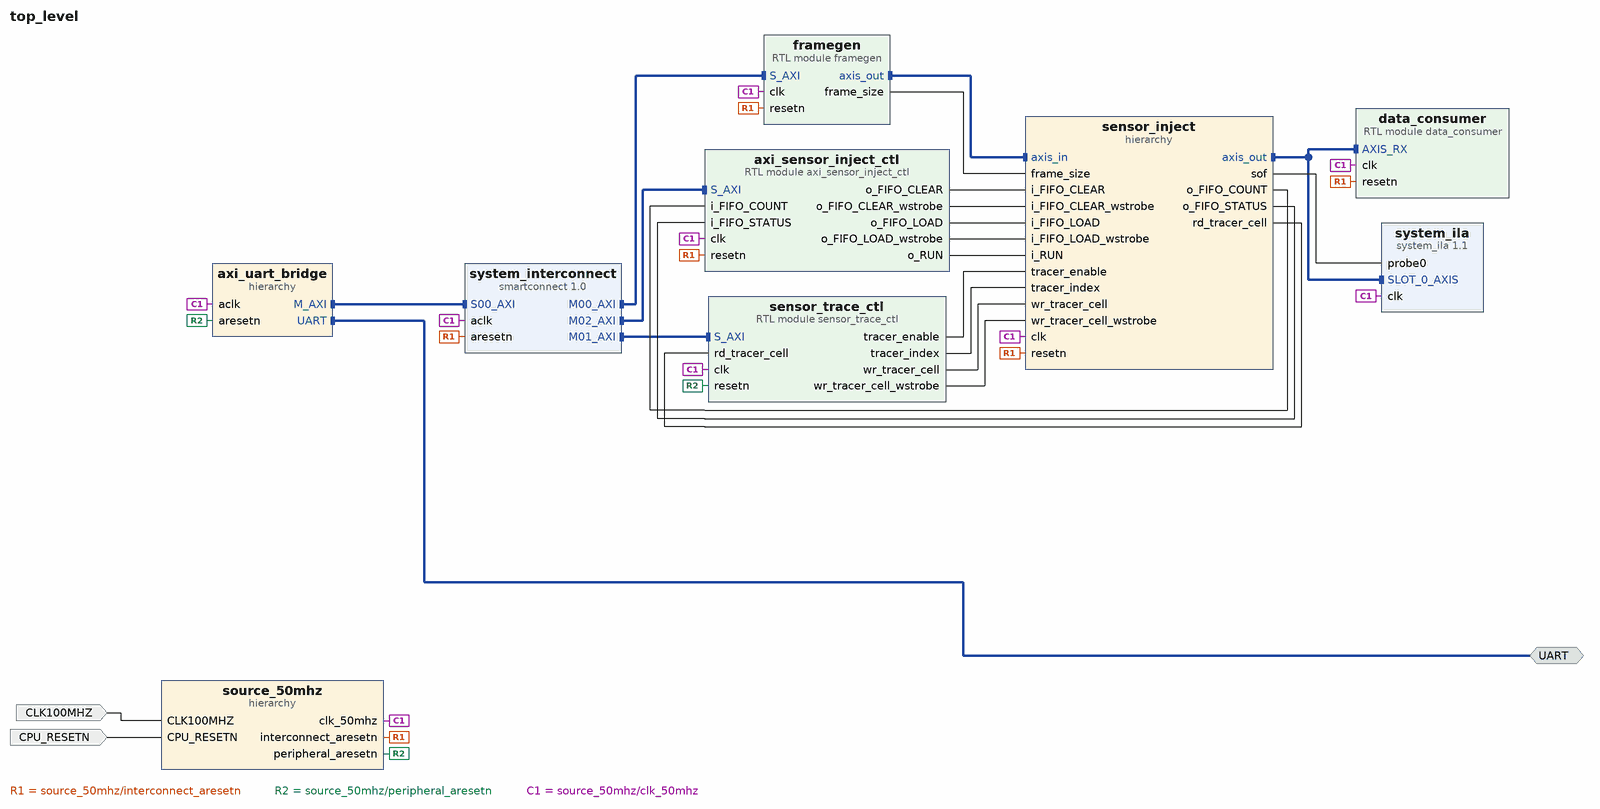
[diagram p0: block diagram of the top level]
# Vivado block design top_level, xc7a100tcsg324-1, Vivado 2021.1
create_bd_design top_level

create_bd_intf_port -mode Master -vlnv xilinx.com:interface:uart_rtl:1.0 UART
create_bd_port -dir I -type clk CLK100MHZ
set_property -dict {CONFIG.ASSOCIATED_RESET CPU_RESETN} [get_bd_ports CLK100MHZ]
create_bd_port -dir I -type rst CPU_RESETN

create_bd_cell -type hier source_50mhz
create_bd_cell -type hier axi_uart_bridge
create_bd_cell -type ip -vlnv xilinx.com:ip:smartconnect:1.0 system_interconnect
set_property -dict {CONFIG.NUM_MI 3 CONFIG.NUM_SI 1} [get_bd_cells system_interconnect]
create_bd_cell -type module -reference data_consumer data_consumer
create_bd_cell -type ip -vlnv xilinx.com:ip:system_ila:1.1 system_ila
set_property -dict {CONFIG.C_MON_TYPE MIX CONFIG.C_SLOT_0_INTF_TYPE xilinx.com:interface:axis_rtl:1.0} [get_bd_cells system_ila]
create_bd_cell -type hier sensor_inject
create_bd_cell -type module -reference framegen framegen
create_bd_cell -type module -reference axi_sensor_inject_ctl axi_sensor_inject_ctl
create_bd_cell -type module -reference sensor_trace_ctl sensor_trace_ctl

# ---- hierarchy /source_50mhz ----
current_bd_instance /source_50mhz
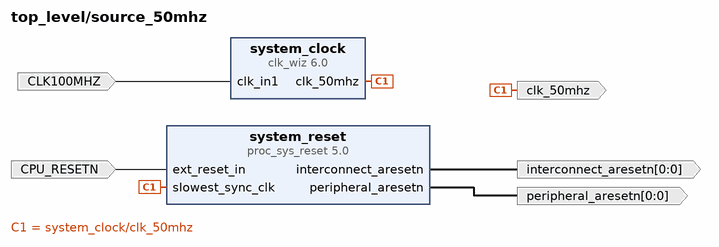
[diagram p1: block diagram inside /source_50mhz]
create_bd_pin -dir I -type clk CLK100MHZ
create_bd_pin -dir O -type clk clk_50mhz
create_bd_pin -dir I -type rst CPU_RESETN
create_bd_pin -dir O -from 0 -to 0 -type rst interconnect_aresetn
create_bd_pin -dir O -from 0 -to 0 -type rst peripheral_aresetn

create_bd_cell -type ip -vlnv xilinx.com:ip:clk_wiz:6.0 system_clock
set_property -dict [list \
  CONFIG.CLKOUT1_DRIVES BUFGCE \
  CONFIG.CLKOUT1_JITTER 151.636 \
  CONFIG.CLKOUT1_REQUESTED_OUT_FREQ 50 \
  CONFIG.CLKOUT2_DRIVES BUFGCE \
  CONFIG.CLKOUT3_DRIVES BUFGCE \
  CONFIG.CLKOUT4_DRIVES BUFGCE \
  CONFIG.CLKOUT5_DRIVES BUFGCE \
  CONFIG.CLKOUT6_DRIVES BUFGCE \
  CONFIG.CLKOUT7_DRIVES BUFGCE \
  CONFIG.CLK_OUT1_PORT clk_50mhz \
  CONFIG.FEEDBACK_SOURCE FDBK_AUTO \
  CONFIG.MMCM_CLKOUT0_DIVIDE_F 20.000 \
  CONFIG.USE_LOCKED false \
  CONFIG.USE_RESET false \
  CONFIG.USE_SAFE_CLOCK_STARTUP true \
] [get_bd_cells system_clock]
create_bd_cell -type ip -vlnv xilinx.com:ip:proc_sys_reset:5.0 system_reset

# ---- hierarchy /axi_uart_bridge ----
current_bd_instance /axi_uart_bridge
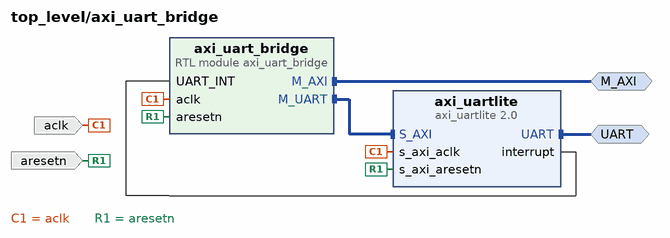
[diagram p2: block diagram inside /axi_uart_bridge]
create_bd_intf_pin -mode Master -vlnv xilinx.com:interface:aximm_rtl:1.0 M_AXI
create_bd_intf_pin -mode Master -vlnv xilinx.com:interface:uart_rtl:1.0 UART
create_bd_pin -dir I -type rst aresetn
create_bd_pin -dir I -type clk aclk

create_bd_cell -type module -reference axi_uart_bridge axi_uart_bridge
create_bd_cell -type ip -vlnv xilinx.com:ip:axi_uartlite:2.0 axi_uartlite
set_property -dict {CONFIG.C_BAUDRATE 115200 CONFIG.C_S_AXI_ACLK_FREQ_HZ 50000000} [get_bd_cells axi_uartlite]

# ---- hierarchy /sensor_inject ----
current_bd_instance /sensor_inject
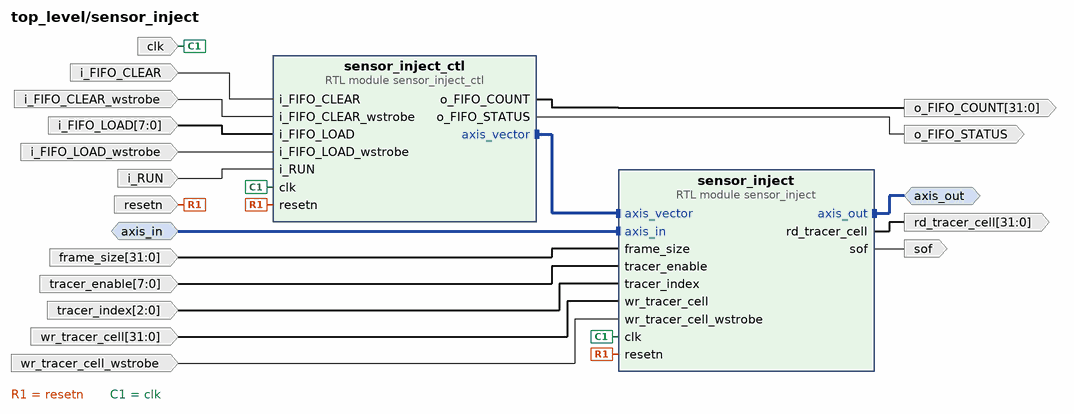
[diagram p3: block diagram inside /sensor_inject]
create_bd_intf_pin -mode Slave -vlnv xilinx.com:interface:axis_rtl:1.0 axis_in
create_bd_intf_pin -mode Master -vlnv xilinx.com:interface:axis_rtl:1.0 axis_out
create_bd_pin -dir I -type clk clk
create_bd_pin -dir I -type rst resetn
create_bd_pin -dir I i_FIFO_CLEAR
create_bd_pin -dir I i_FIFO_CLEAR_wstrobe
create_bd_pin -dir I -from 7 -to 0 i_FIFO_LOAD
create_bd_pin -dir I i_FIFO_LOAD_wstrobe
create_bd_pin -dir I i_RUN
create_bd_pin -dir O o_FIFO_STATUS
create_bd_pin -dir O -from 31 -to 0 o_FIFO_COUNT
create_bd_pin -dir I -from 31 -to 0 frame_size
create_bd_pin -dir I -from 7 -to 0 tracer_enable
create_bd_pin -dir I -from 2 -to 0 tracer_index
create_bd_pin -dir O -from 31 -to 0 rd_tracer_cell
create_bd_pin -dir I -from 31 -to 0 wr_tracer_cell
create_bd_pin -dir I wr_tracer_cell_wstrobe
create_bd_pin -dir O sof

create_bd_cell -type module -reference sensor_inject sensor_inject
create_bd_cell -type module -reference sensor_inject_ctl sensor_inject_ctl
set_property -dict {CONFIG.FIFO_DEPTH 256} [get_bd_cells sensor_inject_ctl]

# ---- connections ----

current_bd_instance /source_50mhz
connect_bd_net [get_bd_pins CLK100MHZ] [get_bd_pins system_clock/clk_in1]
connect_bd_net [get_bd_pins CPU_RESETN] [get_bd_pins system_reset/ext_reset_in]
connect_bd_net -net system_clock_clk_100mhz [get_bd_pins system_clock/clk_50mhz] [get_bd_pins clk_50mhz] [get_bd_pins system_reset/slowest_sync_clk]
connect_bd_net [get_bd_pins system_reset/interconnect_aresetn] [get_bd_pins interconnect_aresetn]
connect_bd_net [get_bd_pins system_reset/peripheral_aresetn] [get_bd_pins peripheral_aresetn]

current_bd_instance /axi_uart_bridge
connect_bd_intf_net [get_bd_intf_pins M_AXI] [get_bd_intf_pins axi_uart_bridge/M_AXI]
connect_bd_intf_net [get_bd_intf_pins UART] [get_bd_intf_pins axi_uartlite/UART]
connect_bd_intf_net [get_bd_intf_pins axi_uart_bridge/M_UART] [get_bd_intf_pins axi_uartlite/S_AXI]
connect_bd_net [get_bd_pins aclk] [get_bd_pins axi_uart_bridge/aclk] [get_bd_pins axi_uartlite/s_axi_aclk]
connect_bd_net [get_bd_pins aresetn] [get_bd_pins axi_uart_bridge/aresetn] [get_bd_pins axi_uartlite/s_axi_aresetn]
connect_bd_net [get_bd_pins axi_uartlite/interrupt] [get_bd_pins axi_uart_bridge/UART_INT]

current_bd_instance /sensor_inject
connect_bd_intf_net -intf_net framegen_axis_out [get_bd_intf_pins axis_in] [get_bd_intf_pins sensor_inject/axis_in]
connect_bd_intf_net [get_bd_intf_pins axis_out] [get_bd_intf_pins sensor_inject/axis_out]
connect_bd_intf_net [get_bd_intf_pins sensor_inject_ctl/axis_vector] [get_bd_intf_pins sensor_inject/axis_vector]
connect_bd_net -net axi_sensor_trace_ctl_o_FIFO_CLEAR [get_bd_pins i_FIFO_CLEAR] [get_bd_pins sensor_inject_ctl/i_FIFO_CLEAR]
connect_bd_net -net axi_sensor_trace_ctl_o_FIFO_CLEAR_wstrobe [get_bd_pins i_FIFO_CLEAR_wstrobe] [get_bd_pins sensor_inject_ctl/i_FIFO_CLEAR_wstrobe]
connect_bd_net -net axi_sensor_trace_ctl_o_FIFO_LOAD [get_bd_pins i_FIFO_LOAD] [get_bd_pins sensor_inject_ctl/i_FIFO_LOAD]
connect_bd_net -net axi_sensor_trace_ctl_o_FIFO_LOAD_wstrobe [get_bd_pins i_FIFO_LOAD_wstrobe] [get_bd_pins sensor_inject_ctl/i_FIFO_LOAD_wstrobe]
connect_bd_net -net axi_sensor_trace_ctl_o_RUN [get_bd_pins i_RUN] [get_bd_pins sensor_inject_ctl/i_RUN]
connect_bd_net -net framegen_frame_size [get_bd_pins frame_size] [get_bd_pins sensor_inject/frame_size]
connect_bd_net [get_bd_pins sensor_inject_ctl/o_FIFO_COUNT] [get_bd_pins o_FIFO_COUNT]
connect_bd_net [get_bd_pins sensor_inject_ctl/o_FIFO_STATUS] [get_bd_pins o_FIFO_STATUS]
connect_bd_net [get_bd_pins sensor_inject/rd_tracer_cell] [get_bd_pins rd_tracer_cell]
connect_bd_net [get_bd_pins sensor_inject/sof] [get_bd_pins sof]
connect_bd_net -net sensor_trace_ctl_tracer_enable [get_bd_pins tracer_enable] [get_bd_pins sensor_inject/tracer_enable]
connect_bd_net -net sensor_trace_ctl_tracer_index [get_bd_pins tracer_index] [get_bd_pins sensor_inject/tracer_index]
connect_bd_net -net sensor_trace_ctl_wr_tracer_cell [get_bd_pins wr_tracer_cell] [get_bd_pins sensor_inject/wr_tracer_cell]
connect_bd_net -net sensor_trace_ctl_wr_tracer_cell_wstrobe [get_bd_pins wr_tracer_cell_wstrobe] [get_bd_pins sensor_inject/wr_tracer_cell_wstrobe]
connect_bd_net -net source_100mhz_interconnect_aresetn [get_bd_pins resetn] [get_bd_pins sensor_inject/resetn] [get_bd_pins sensor_inject_ctl/resetn]
connect_bd_net -net system_clock_clk_100mhz [get_bd_pins clk] [get_bd_pins sensor_inject/clk] [get_bd_pins sensor_inject_ctl/clk]

current_bd_instance /
connect_bd_intf_net [get_bd_intf_pins framegen/axis_out] [get_bd_intf_pins sensor_inject/axis_in]
connect_bd_intf_net -intf_net hier_0_M_AXI [get_bd_intf_pins system_interconnect/S00_AXI] [get_bd_intf_pins axi_uart_bridge/M_AXI]
connect_bd_intf_net -intf_net hier_0_UART [get_bd_intf_ports UART] [get_bd_intf_pins axi_uart_bridge/UART]
connect_bd_intf_net [get_bd_intf_pins data_consumer/AXIS_RX] [get_bd_intf_pins sensor_inject/axis_out]
connect_bd_intf_net [get_bd_intf_pins data_consumer/AXIS_RX] [get_bd_intf_pins system_ila/SLOT_0_AXIS]
connect_bd_intf_net [get_bd_intf_pins framegen/S_AXI] [get_bd_intf_pins system_interconnect/M00_AXI]
connect_bd_intf_net [get_bd_intf_pins sensor_trace_ctl/S_AXI] [get_bd_intf_pins system_interconnect/M01_AXI]
connect_bd_intf_net [get_bd_intf_pins axi_sensor_inject_ctl/S_AXI] [get_bd_intf_pins system_interconnect/M02_AXI]
connect_bd_net [get_bd_ports CLK100MHZ] [get_bd_pins source_50mhz/CLK100MHZ]
connect_bd_net [get_bd_ports CPU_RESETN] [get_bd_pins source_50mhz/CPU_RESETN]
connect_bd_net -net axi_sensor_inject_ctl_0_o_FIFO_CLEAR [get_bd_pins axi_sensor_inject_ctl/o_FIFO_CLEAR] [get_bd_pins sensor_inject/i_FIFO_CLEAR]
connect_bd_net -net axi_sensor_inject_ctl_0_o_FIFO_CLEAR_wstrobe [get_bd_pins axi_sensor_inject_ctl/o_FIFO_CLEAR_wstrobe] \
  [get_bd_pins sensor_inject/i_FIFO_CLEAR_wstrobe]
connect_bd_net -net axi_sensor_inject_ctl_0_o_FIFO_LOAD [get_bd_pins axi_sensor_inject_ctl/o_FIFO_LOAD] [get_bd_pins sensor_inject/i_FIFO_LOAD]
connect_bd_net -net axi_sensor_inject_ctl_0_o_FIFO_LOAD_wstrobe [get_bd_pins axi_sensor_inject_ctl/o_FIFO_LOAD_wstrobe] \
  [get_bd_pins sensor_inject/i_FIFO_LOAD_wstrobe]
connect_bd_net -net axi_sensor_inject_ctl_0_o_RUN [get_bd_pins axi_sensor_inject_ctl/o_RUN] [get_bd_pins sensor_inject/i_RUN]
connect_bd_net [get_bd_pins framegen/frame_size] [get_bd_pins sensor_inject/frame_size]
connect_bd_net [get_bd_pins sensor_inject/o_FIFO_COUNT] [get_bd_pins axi_sensor_inject_ctl/i_FIFO_COUNT]
connect_bd_net [get_bd_pins sensor_inject/o_FIFO_STATUS] [get_bd_pins axi_sensor_inject_ctl/i_FIFO_STATUS]
connect_bd_net [get_bd_pins sensor_inject/rd_tracer_cell] [get_bd_pins sensor_trace_ctl/rd_tracer_cell]
connect_bd_net [get_bd_pins sensor_inject/sof] [get_bd_pins system_ila/probe0]
connect_bd_net [get_bd_pins sensor_trace_ctl/tracer_enable] [get_bd_pins sensor_inject/tracer_enable]
connect_bd_net [get_bd_pins sensor_trace_ctl/tracer_index] [get_bd_pins sensor_inject/tracer_index]
connect_bd_net [get_bd_pins sensor_trace_ctl/wr_tracer_cell] [get_bd_pins sensor_inject/wr_tracer_cell]
connect_bd_net [get_bd_pins sensor_trace_ctl/wr_tracer_cell_wstrobe] [get_bd_pins sensor_inject/wr_tracer_cell_wstrobe]
connect_bd_net -net source_100mhz_interconnect_aresetn [get_bd_pins source_50mhz/interconnect_aresetn] \
  [get_bd_pins system_interconnect/aresetn] [get_bd_pins data_consumer/resetn] [get_bd_pins sensor_inject/resetn] \
  [get_bd_pins framegen/resetn] [get_bd_pins axi_sensor_inject_ctl/resetn]
connect_bd_net -net source_100mhz_peripheral_aresetn [get_bd_pins source_50mhz/peripheral_aresetn] \
  [get_bd_pins axi_uart_bridge/aresetn] [get_bd_pins sensor_trace_ctl/resetn]
connect_bd_net -net system_clock_clk_100mhz [get_bd_pins source_50mhz/clk_50mhz] \
  [get_bd_pins axi_uart_bridge/aclk] [get_bd_pins system_interconnect/aclk] [get_bd_pins data_consumer/clk] \
  [get_bd_pins system_ila/clk] [get_bd_pins sensor_inject/clk] [get_bd_pins framegen/clk] \
  [get_bd_pins axi_sensor_inject_ctl/clk] [get_bd_pins sensor_trace_ctl/clk]

# ---- address map ----
assign_bd_address -offset 0x0000000000001000 -range 256 -target_address_space [get_bd_addr_spaces axi_uart_bridge/axi_uart_bridge/M_AXI] [get_bd_addr_segs framegen/S_AXI/reg0]
assign_bd_address -offset 0x0000000000002000 -range 256 -target_address_space [get_bd_addr_spaces axi_uart_bridge/axi_uart_bridge/M_AXI] [get_bd_addr_segs axi_sensor_inject_ctl/S_AXI/reg0]
assign_bd_address -offset 0x0000000000004000 -range 256 -target_address_space [get_bd_addr_spaces axi_uart_bridge/axi_uart_bridge/M_AXI] [get_bd_addr_segs sensor_trace_ctl/S_AXI/reg0]
assign_bd_address -offset 0x40600000 -range 64K -target_address_space [get_bd_addr_spaces axi_uart_bridge/axi_uart_bridge/M_UART] [get_bd_addr_segs axi_uart_bridge/axi_uartlite/S_AXI/Reg]

validate_bd_design
save_bd_design
